# Altium project Capstone-PCB.PrjPcb
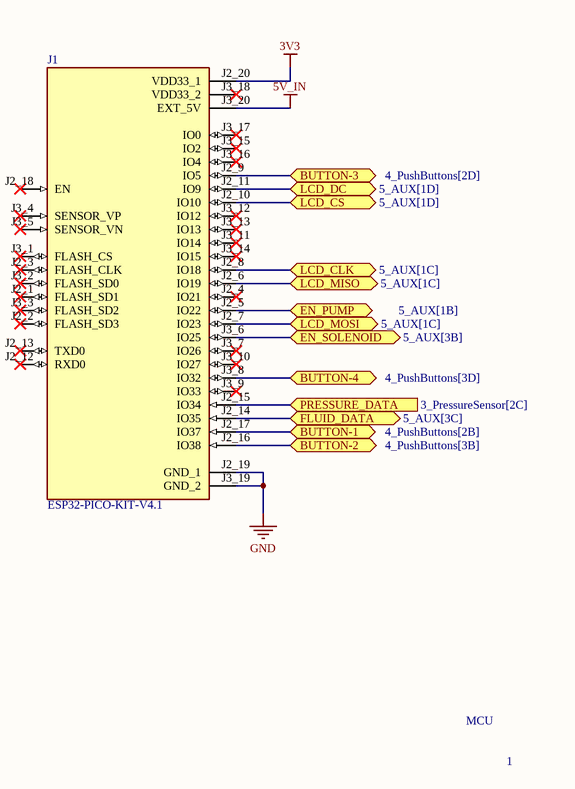
[diagram p0: 1_MCU.SchDoc]
3 sheets, 9 parts. Net scope: flat (ports and power ports of the same name join across sheets).
Board file: PCB1.PcbDoc
Sheets:
  1_MCU.SchDoc
  2_Power.SchDoc
  5_AUX.SchDoc

## Sheet 1_MCU.SchDoc
size A4; SheetNumber: 1; SheetTotal: 5

### Parts
J1  ESP32-PICO-KIT-V4.1  [XCVR_ESP32-PICO-KIT-V4.1]

### Ports
BUTTON-1 (bidir, see 4_PushButtons[2B]), BUTTON-2 (bidir, see 4_PushButtons[3B]), BUTTON-3 (bidir, see 4_PushButtons[2D]), BUTTON-4 (bidir, see 4_PushButtons[3D]), EN_PUMP (bidir, see 5_AUX[1B]), EN_SOLENOID (bidir, see 5_AUX[3B]), FLUID_DATA (bidir, see 5_AUX[3C]), LCD_CLK (bidir, see 5_AUX[1C]), LCD_CS (bidir, see 5_AUX[1D]), LCD_DC (bidir, see 5_AUX[1D]), LCD_MISO (bidir, see 5_AUX[1C]), LCD_MOSI (bidir, see 5_AUX[1C]), PRESSURE_DATA (in, see 3_PressureSensor[2C])

### Nets
3V3: J1.J2_20(VDD33_1)
5V_IN: J1.J3_20(EXT_5V)
GND: J1.J2_19(GND_1) J1.J3_19(GND_2)
CLK: J1.J2_8(IO18) ; port LCD_CLK
CS: J1.J2_10(IO10) ; port LCD_CS
DC: J1.J2_11(IO9) ; port LCD_DC
FLUID_DATA: J1.J2_14(IO35) ; port FLUID_DATA
MISO: J1.J2_6(IO19) ; port LCD_MISO
MOSI: J1.J2_7(IO23) ; port LCD_MOSI
NetJ1_J2_5: J1.J2_5(IO22) ; port EN_PUMP
NetJ1_J2_9: J1.J2_9(IO5) ; port BUTTON-3
NetJ1_J2_15: J1.J2_15(IO34) ; port PRESSURE_DATA
NetJ1_J2_16: J1.J2_16(IO38) ; port BUTTON-2
NetJ1_J2_17: J1.J2_17(IO37) ; port BUTTON-1
NetJ1_J3_6: J1.J3_6(IO25) ; port EN_SOLENOID
NetJ1_J3_8: J1.J3_8(IO32) ; port BUTTON-4

Not connected (* = marked no-connect by the designer): J1 J2_1(FLASH_SD1)* J2_2(FLASH_SD3)* J2_3(FLASH_CLK)* J2_4(IO21)* J2_12(RXD0)* J2_13(TXD0)* J2_18(EN)* J3_1(FLASH_CS)* J3_2(FLASH_SD0)* J3_3(FLASH_SD2)* J3_4(SENSOR_VP)* J3_5(SENSOR_VN)* J3_7(IO26)* J3_9(IO33)* J3_10(IO27)* J3_11(IO14)* J3_12(IO12)* J3_13(IO13)* J3_14(IO15)* J3_15(IO2)* J3_16(IO4)* J3_17(IO0)* J3_18(VDD33_2)*

### Notes on the sheet
- MCU
- 1

### Library data of the parts
J1 = CMP-003-000001-1: WiFi Development Tools (802.11); MF: Espressif Systems; Availability: Bad; Value: *; Source: ESP32-PICO-KIT-V4.1.SchLib; Check_prices: https://www.snapeda.com/parts/ESP32-PICO-KIT-V4.1/Espressif%20Systems/view-part/3211113/?ref=eda; MP: ESP32-PICO-KIT-V4.1; Component Type: Standard; Price: None; SnapEDA_Link: https://www.snapeda.com/parts/ESP32-PICO-KIT-V4.1/Espressif%20Systems/view-part/3211113/?ref=snap; Design Item ID: ESP32-PICO-KIT-V4.1; Pin Count: 40; Package: None

## Sheet 2_Power.SchDoc
size A4; SheetNumber: 2; SheetTotal: 5
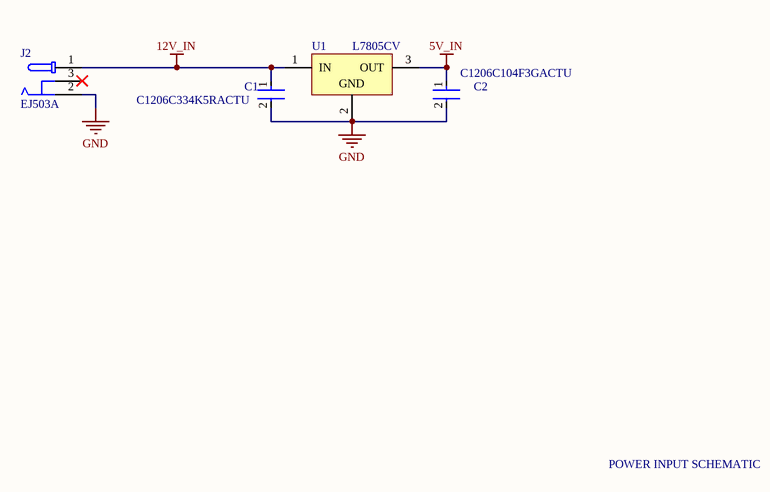
[diagram p1: 2_Power.SchDoc]

### Parts
C1  C1206C334K5RACTU  [FP-C1206C-EB-MFG]
C2  C1206C104F3GACTU  [FP-C1206C-EB-MFG]
J2  EJ503A  [MPD_EJ503A]
U1  L7805CV  [TO220]

### Nets
5V_IN: C2.1 U1.3(OUT)
12V_IN: C1.1 J2.1 U1.1(IN)
GND: C1.2 C2.2 J2.2 U1.2(GND)

Not connected (* = marked no-connect by the designer): J2 3*

### Notes on the sheet
- POWER INPUT SCHEMATIC

### Library data of the parts
C1 = CMP-1037-04487-2: CAP CER 0.33UF 50V X7R 1206; Manufacturer: KEMET; Tolerance: 0.1; Automotive Grade: Grade 0; Value: 0.33 μF; Material: Ceramic; Temperature Coefficient: 15%; Ipc Land Pattern Name: CAPC320160X78; Octopart: https://octopart.com/c1206c334k5ractu-kemet-146059; Height: 0.88mm; Package: C1206C-EB; Manufacturer Part Number: C1206C334K5RACTU; ComponentLink2Description: Datasheet; Digikey Description: CAP CER 0.33UF 50V X7R 1206; Voltage Rating: 50 V; Temperature Range High: +150°C; Temperature: -55°C to +150°C; Automotive: Yes; Lead Free: Yes; Mouser Description: Multilayer Ceramic Capacitors MLCC - SMD/SMT 50volts 0.33uF X7R 10%; Category: Cap; RoHS: TRUE; Temperature Characteristic: X7R; Capacitance: 0.33 μF; Device Class L1: Passive Components; Temperature Range Low: -55°C; Device Class L2: Capacitors; Device Class L3: Ceramic Capacitors; ComponentLink2URL: https://content.kemet.com/datasheets/KEM_C1007_X8R_ULTRA_150C_SMD.pdf
C2 = CMP-1037-04186-2: CAP CER 0.1UF 25V C0G/NP0 1206; Manufacturer: KEMET; Material: Ceramic; Value: 0.10 μF; Temperature Characteristic: C0G; Temperature Coefficient: 15%; Tolerance: 0.01; Automotive Grade: Grade 0; Device Class L3: Ceramic Capacitors; Voltage Rating: 25 V; Temperature Range Low: -55°C; RoHS: TRUE; Package: C1206C-EB; Category: Cap; Lead Free: Yes; Manufacturer Part Number: C1206C104F3GACTU; ComponentLink2URL: https://content.kemet.com/datasheets/KEM_C1007_X8R_ULTRA_150C_SMD.pdf; Ipc Land Pattern Name: CAPC320160X78; Temperature Range High: +150°C; Height: 0.88mm; Digikey Description: CAP CER 0.1UF 25V C0G/NP0 1206; ComponentLink2Description: Datasheet; Capacitance: 0.10 μF; Mouser Description: Multilayer Ceramic Capacitors MLCC - SMD/SMT 25volts 0.1uF 1% C0G; Octopart: https://octopart.com/c1206c104f3gactu-kemet-13149870; Device Class L1: Passive Components; Device Class L2: Capacitors; Automotive: Yes; Temperature: -55°C to +150°C
J2 = CMP-002-00071-1: Power Barrel Connector Jack 2.10mm ID (0.083), 5.50mm OD (0.217) Through Hole, Right Angle; MF: MPD; SnapEDA_Link: https://www.snapeda.com/parts/EJ503A/MPD+%2528Memory+Protection+Devices%2529/view-part/?ref=snap; Design Item ID: EJ503A; Purchase-URL: https://pricing.snapeda.com/search?q=EJ503A&ref=eda; Price: None; Component Type: Standard; Check_prices: https://www.snapeda.com/parts/EJ503A/MPD+%2528Memory+Protection+Devices%2529/view-part/?ref=eda; Case/Package: None; MP: EJ503A; Value: *; Pins: 3; Availability: In Stock; Source: EJ503A.SchLib
U1 = CMP-0244-00483-1: Positive Voltage Regulator, 5V, 3-Pin TO-220; PackageDescription: TO, Thru-Hole, Vertical, Heatsink Mounted; 3 In-Line Leads; Pitch 2.54 mm; ComponentLink2Description: Datasheet; PackageReference: TO220; ComponentLink3URL: http://www.st.com/internet/com/TECHNICAL_RESOURCES/TECHNICAL_LITERATURE/PACKAGE_INFORMATION/CD00004649.pdf; DatasheetVersion: 16/11/2011; ComponentLink1Description: Manufacturer URL; ComponentLink1URL: http://www.st.com; PackageVersion: ver3.0; ComponentLink3Description: Package Specification; ComponentLink2URL: http://www.st.com/internet/com/TECHNICAL_RESOURCES/TECHNICAL_LITERATURE/DATASHEET/CD00000444.pdf

## Sheet 5_AUX.SchDoc
size A4; SheetNumber: 5; SheetTotal: 5
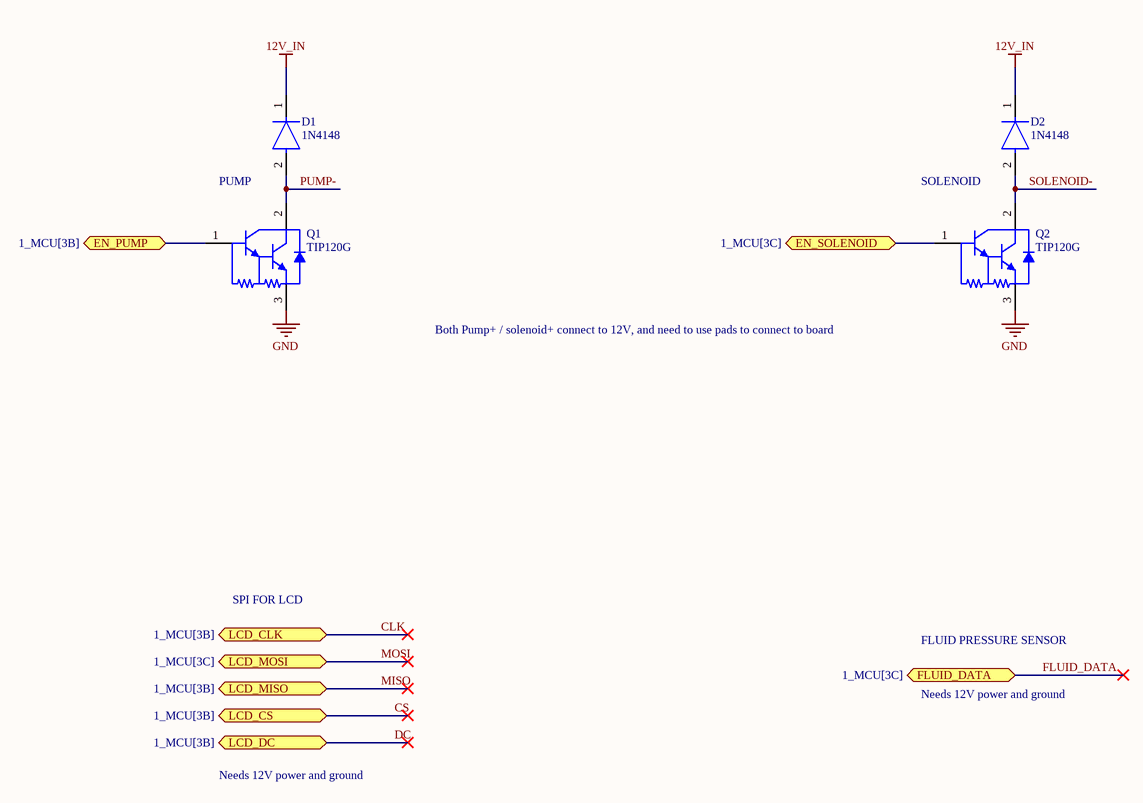
[diagram p2: 5_AUX.SchDoc]

### Parts
D1  1N4148  [FP-017AG-MFG]
D2  1N4148  [FP-017AG-MFG]
Q1  TIP120G  [ONSC-TO-220-3-221A-09]
Q2  TIP120G  [ONSC-TO-220-3-221A-09]

### Ports
EN_PUMP (bidir, see 1_MCU[3B]), EN_SOLENOID (bidir, see 1_MCU[3C]), FLUID_DATA (bidir, see 1_MCU[3C]), LCD_CLK (bidir, see 1_MCU[3B]), LCD_CS (bidir, see 1_MCU[3B]), LCD_DC (bidir, see 1_MCU[3B]), LCD_MISO (bidir, see 1_MCU[3B]), LCD_MOSI (bidir, see 1_MCU[3C])

### Nets
12V_IN: D1.1(C) D2.1(C)
GND: Q1.3(E) Q2.3(E)
PUMP-: D1.2(A) Q1.2(C)
SOLENOID-: D2.2(A) Q2.2(C)
NetJ1_J2_5: Q1.1(B) ; port EN_PUMP
NetJ1_J3_6: Q2.1(B) ; port EN_SOLENOID

### Notes on the sheet
- PUMP
- SOLENOID
- Both Pump+ / solenoid+ connect to 12V, and need to use pads to connect to board
- SPI FOR LCD
- FLUID PRESSURE SENSOR
- Needs 12V power and ground

### Library data of the parts
D1 D2 = CMP-07163-000046-1: DIODE GEN PURP 100V 200MA DO35; Forward Voltage: 1V; Max Power Dissipation: 500mW; Max Reverse Current: 5uA; Forward Current: 300mA; Current: 4A; Reverse Recovery Time: 4ns; Element Configuration: Single; Outside Diameter: 1.85mm; Capacitance: 4pF; Polarity: Standard; Max Forward Surge Current (Ifsm): 1A; Reverse Voltage: 100V; Output Current: 200mA; Average Rectified Current: 200mA; Diameter: 1.91mm; Max Repetitive Reverse Voltage (Vrrm): 100V; Current Rating: 200mA; Case/Package: DO-35; Lead Free: Lead Free; Number of Pins: 2; Recovery Time: 4ns; Packaging: Bulk; Contact Plating: Tin; Voltage: 100V; Mount: Through Hole; Max Surge Current: 4A; Package Quantity: 2000; Width: 1.91mm; Max Reverse Voltage (DC): 100V; Length: 4.56mm; Radiation Hardening: No; Power Dissipation: 500mW; Voltage Rating (DC): 100V; Peak Non-Repetitive Surge Current: 4A; REACH SVHC: No SVHC; Height: 4.56mm; Max Operating Temperature: 175°C; Series: -; Weight: 0.01lb; Min Operating Temperature: -65°C
Q1 Q2 = CMP-1047-00134-1: Plastic Medium-Power, Complementary Silicon Transistor, 3-Pin TO-220, Pb-Free, Tube; Manufacturer: On Semiconductor; Polarity: NPN; IC Continuous (A): 5; PackageDescription: 3-Pin Flange Mount, Vertical Straight Lead, Body 9.97 x 4.445 mm, Pitch 2.54 mm; PackageVersion: Rev. AG, 09/2011; ComponentLink2Description: Datasheet; DatasheetVersion: Rev. 8; Mounting Technology: Through Hole; ComponentLink1URL: http://www.onsemi.com/; RoHS: TRUE; ComponentLink3URL: http://www.onsemi.com/pub_link/Collateral/221A-09.PDF; ComponentLink3Description: Package Specification; ComponentLink1Description: Manufacturer URL; Packing: Tube; PackageReference: TO-220-3-221A-09; ComponentLink2URL: http://www.onsemi.cn/pub_link/Collateral/TIP120-D.PDF; PartNumber: TIP120G

## Nets that join several sheets
5V_IN: 1_MCU (J1.J3_20), 2_Power (C2.1 U1.3)
12V_IN: 2_Power (C1.1 J2.1 U1.1), 5_AUX (D1.1 D2.1)
GND: 1_MCU (J1.J2_19 J1.J3_19), 2_Power (C1.2 C2.2 J2.2 U1.2), 5_AUX (Q1.3 Q2.3)
NetJ1_J2_5: 1_MCU (J1.J2_5), 5_AUX (Q1.1)
NetJ1_J3_6: 1_MCU (J1.J3_6), 5_AUX (Q2.1)